# Altium schematic sheet MCU.SchDoc
size A; DocumentNumber: 2; SheetNumber: 2; SheetTotal: 3
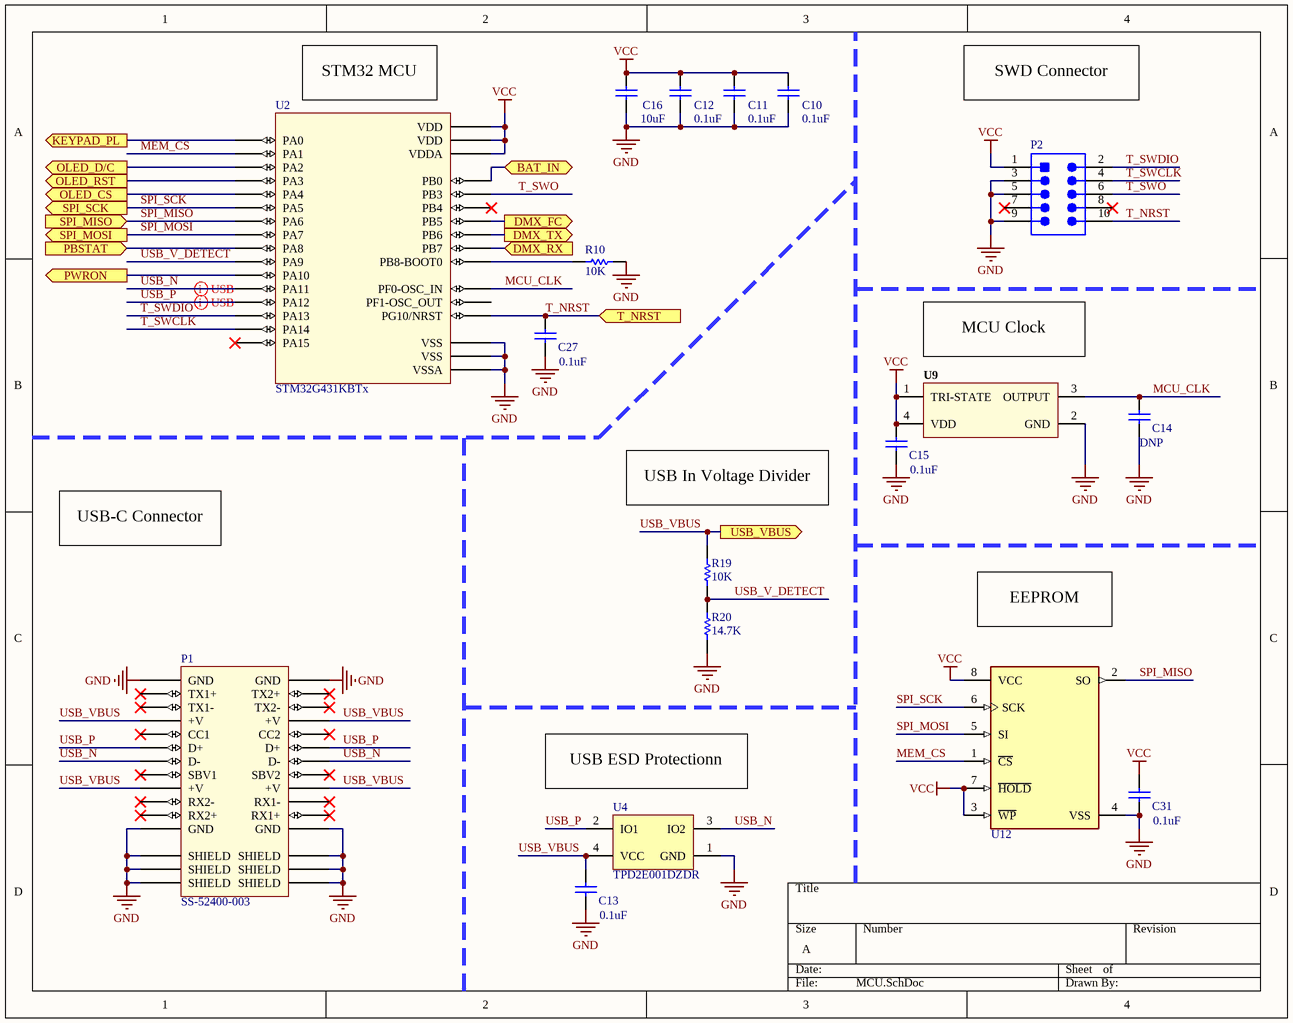
[diagram p0: MCU.SchDoc]

## Parts
C10  0.1uF  [CAPC0603(1608)100_L]
C11  0.1uF  [CAPC0603(1608)100_L]
C12  0.1uF  [CAPC0603(1608)100_L]
C13  0.1uF  [CAPC0603(1608)100_L]
C14  DNP  [CAPC0603(1608)100_L]
C15  0.1uF  [CAPC0603(1608)100_L]
C16  10uF  [CAPC0603(1608)100_L]
C27  0.1uF  [CAPC0603(1608)100_L]
C31  0.1uF  [CAPC0603(1608)100_L]
P1  SS-52400-003  [SS-52400-00X]
P2  FTSH-105-01-F-DV-K  [SMTC-FTSH-105-01-L-DV-K_V]  (value not drawn)
R10  10K  [RESC0603(1608)_N]
R19  10K  [RESC0603(1608)_N]
R20  14.7K  [RESC0603(1608)_N]
U2  STM32G431KBTx  [LQFP32]
U4  TPD2E001DZDR  [DZD0004A_N]
U9  XLH536024.000000I  [ECS-396X_V]  (value not drawn)
U12  CAT25640VI-GT3  [FP-CAT25256VI-GT3-IPC_B]  (value not drawn)

## Ports
BAT_IN (bidir), DMX_FC (out), DMX_RX (in), DMX_TX (out), KEYPAD_PL (out), OLED_CS (out), OLED_D/C (out), OLED_RST (out), PBSTAT (in), PWRON (out), SPI_MISO (in), SPI_MOSI (out), SPI_SCK (out), T_NRST (in), USB_VBUS (out)

## Nets
GND: C10.1 C11.1 C12.1 C13.1 C14.1 C15.1 C16.1 C27.1 C31.1 P1.A1(GND) P1.A12(GND) P1.B1(GND) P1.B12(GND) P1.G1(SHIELD) P1.G2(SHIELD) P1.G3(SHIELD) P1.G4(SHIELD) P1.G5(SHIELD) P1.G6(SHIELD) P2.3 P2.5 P2.9 R10.2 R20.1 U2.14(VSSA) U2.16(VSS) U2.32(VSS) U4.1(GND) U9.2(GND) U12.4(VSS)
VCC: C10.2 C11.2 C12.2 C15.2 C16.2 C31.2 P2.1 U2.1(VDD) U2.15(VDDA) U2.17(VDD) U9.1(TRI-STATE) U9.4(VDD) U12.3(~{WP}) U12.7(~{HOLD}) U12.8(VCC)
BAT_IN: U2.13(PB0) ; port BAT_IN
DMX_FC: U2.28(PB5) ; port DMX_FC
DMX_RX: U2.30(PB7) ; port DMX_RX
DMX_TX: U2.29(PB6) ; port DMX_TX
KEYPAD_PL: U2.5(PA0) ; port KEYPAD_PL
MCU_CLK: C14.2 U2.2(PF0-OSC_IN) U9.3(OUTPUT)
MEM_CS: U2.6(PA1) U12.1(~{CS})
OLED_CS: U2.9(PA4) ; port OLED_CS
OLED_D/C: U2.7(PA2) ; port OLED_D/C
OLED_RST: U2.8(PA3) ; port OLED_RST
PBSTAT: U2.18(PA8) ; port PBSTAT
PWRON: U2.20(PA10) ; port PWRON
SPI_MISO: U2.11(PA6) U12.2(SO) ; port SPI_MISO
SPI_MOSI: U2.12(PA7) U12.5(SI) ; port SPI_MOSI
SPI_SCK: U2.10(PA5) U12.6(SCK) ; port SPI_SCK
T_NRST: C27.2 P2.10 U2.4(PG10/NRST) ; port T_NRST
T_SWCLK: P2.4 U2.24(PA14)
T_SWDIO: P2.2 U2.23(PA13)
T_SWO: P2.6 U2.26(PB3)
USB_N: P1.A7(D-) P1.B7(D-) U2.21(PA11) U4.3(IO2)
USB_P: P1.A6(D+) P1.B6(D+) U2.22(PA12) U4.2(IO1)
USB_V_DETECT: R19.2 R20.2 U2.19(PA9)
USB_VBUS: C13.2 P1.A4(+V) P1.A9(+V) P1.B4(+V) P1.B9(+V) R19.1 U4.4(VCC) ; port USB_VBUS
NetR10_1: R10.1 U2.31(PB8-BOOT0)

Not connected (* = marked no-connect by the designer): P1 A2(TX1+)* A3(TX1-)* A5(CC1)* A8(SBV1)* A10(RX2-)* A11(RX2+)* B2(TX2+)* B3(TX2-)* B5(CC2)* B8(SBV2)* B10(RX1-)* B11(RX1+)*; P2 7* 8*; U2 3(PF1-OSC_OUT) 25(PA15)* 27(PB4)*

## Layout directives
differential pair: USB_N, USB_P

## Notes on the sheet
- (near U2) STM32 MCU
- SWD Connector
- (near U9) MCU Clock
- USB In Voltage Divider
- USB-C Connector
- EEPROM
- (near U4) USB ESD Protectionn

## Library data of the parts
C10-C16 C27 C31 = CMP-1035-00873-1: CAP 27pF 16V ±0.5pF 0603 (1608 Metric) Thickness 1mm SMD; Tolerance: Â±0.5pF; Case-Metric: 1608; Case-EIA: 0603; Value: 27pF; Max Thickness: 1 mm; Rated Voltage: 16 V; Technology: SMT
P2 = CMP-2000-05352-1: Male Header, Pitch 1.27 mm, 2 x 5 Position, Height 6.12 mm, RoHS, Tube; Manufacturer: Samtec; Number of Positions: 10; Connector Type: Header,Shrouded; Number of Positions Loaded: All; Row Spacing: 0.050"(1.27mm); Fastening Type: -; Package Reference: FTSH-105-01-L-DV-K; Termination: Solder; Package URL: http://suddendocs.samtec.com/prints/ftsh-1xx-xx-xxx-dv-xxx-footprint.pdf; Number of Rows: 2; Contact Finish Thickness: 3µin(0.08µm); Contact Type: MalePin; Manufacturer URL: http://www.samtec.com/; Contact Mating Length: 0.120"(3.05mm); Pitch: 0.050"(1.27mm); Series: FTSH; Features: -; Contact Finish: Gold; Color: Black; Family: RectangularConnectors-Headers,MalePins; Datasheet URL: http://suddendocs.samtec.com/prints/ftsh-1xx-xx-xxx-dv-xxx-mkt.pdf; Package Description: Male Header, Pitch 1.27 mm, 2 x 5 Position, Height 5.97 mm, Tail Length 4.32 mm; Mounting Type: SurfaceMount; Datasheet Version: Rev. ET, 10/1995; Category: Connectors,Interconnects; Packaging: Tube
R10 R19 R20 = CMP-1012-00001-1: Jumper 0603 (1608 Metric); Case-Metric: 1608; Value: 0.00 Ohm; Power: None; Case-EIA: 0603; Technology: SMT; Tolerance: None
U4 = CMP-2000-04961-1: Low-Capacitance 2-Channel ESD-Protection Array for High-Speed Data Interface, 0.9 to 5.5 V, -40 to 85 degC, 4-Pin SOP (DZD), Green (RoHS & no Sb/Br), Tape and Reel; Manufacturer: Texas Instruments; Manufacturer Product Page: TPD2E001DZDRSpecifications; Voltage - Reverse Standoff (Typ): 5.5V(Max); Online Catalog: TPD2ESeries; EDA / CAD Models: DownloadfromAcceleratedDesigns; Product Training Modules: ESDProtectionBasics; Bidirectional Channels: 2; Voltage - Breakdown (Min): 11V; Other Names: 296-24770-6; Power Line Protection: Yes; Package Reference: DZD4; Family: TVS-Diodes; Operating Temperature: -40degC~85degC(TA); Package / Case: TO-253-4,TO-253AA; Supplier Device Package: 4-SOP; Power - Peak Pulse: -; Type: Steering(RailtoRail); Unidirectional Channels: -; Standard Package: 1; Category: CircuitProtection; Datasheet Version: Rev. H, 08/2014; Capacitance @ Frequency: -; Packaging: Digi-Reel; Manufacturer URL: http://www.ti.com/; Series: -; Voltage - Clamping (Max) @ Ipp: -; Applications: Ethernet; Mounting Type: SurfaceMount; Current - Peak Pulse (10/1000µs): -; Datasheet URL: http://www.ti.com/general/docs/lit/getliterature.tsp?genericPartNumber=TPD2E001&fileType=pdf; Package Description: 4-Pin Small Outline Package, Body 2.92 x 1.3 mm, Pitch 1.92 mm
U9 = CMP-2000-06192-1: Clock Oscillator, 3.3 V, 25 MHz, -55 to 125 degC, 4-Pin SMD, RoHS, Tape and Reel; Manufacturer: ECS; Supply Voltage: 3.3V; Frequency Stability: 100PPM; Output Format: HCMOS; Load Capacitance: 30pF; Frequency: 25Hz; Series: ECS3963; Mounting Technology: SurfaceMount; Package / Case: 5mmx3.2mm; Dimensions: 3.2mmWx5mmL; Minimum Operating Temperature: -55C; Manufacturer URL: https://www.ecsxtal.com/; Product: SMDOscillators; Datasheet Version: 04/2012; Datasheet URL: http://www.mouser.com/ds/2/122/ecs-3961_3963-18682.pdf; Package Reference: 396X; Package Description: 4-Pin Surface Mount Device, Body 5 x 3.2 mm, Pitch 2.54 mm; Maximum Operating Temperature: +125C; RoHS: Details; Termination Style: SMD/SMT; Packaging: Reel
U12 = CMP-07117-000003-1: IC EEPROM 256K SPI 20MHZ 8SOIC; Manufacturer: ON Semiconductor; Manufacturer Part Number: CAT25256VI-GT3; Max Supply Voltage: 5.5V; Standoff Height: 0.1mm; Memory Size: 256Kbits; Nominal Supply Current: 2-4mA; Min Supply Voltage: 1.8V; RoHS: TRUE; Temperature: -40°C to +85°C; Category: IC; Mouser Description: EEPROM Serial-SPI 256K-bit 32K x 8 2.5V/3.3V/5V 8-Pin SOIC N T/R; Lead Free: Yes; Ipc Land Pattern Name: SOIC127P600X155-8; ComponentLink2Description: Datasheet; Digikey Description: IC EEPROM 256K SPI 20MHZ 8SOIC; Memory Type: EEPROM; Footprint Url: https://www.onsemi.com/pub/Collateral/751BD.PDF; Interface: SPI; Automotive: No; Device Class L2: Memory; Octopart: https://octopart.com/cat25256vi-gt3-on+semiconductor-10567745; ComponentLink2URL: https://www.onsemi.cn/PowerSolutions/document/CAT25256-D.PDF; Temperature Range Low: -40°C; Temperature Range High: +85°C; Device Class L3: EEPROM; Height: 1.75mm; Frequency: 20MHz; Package: SOIC8; Device Class L1: Integrated Circuits (ICs)